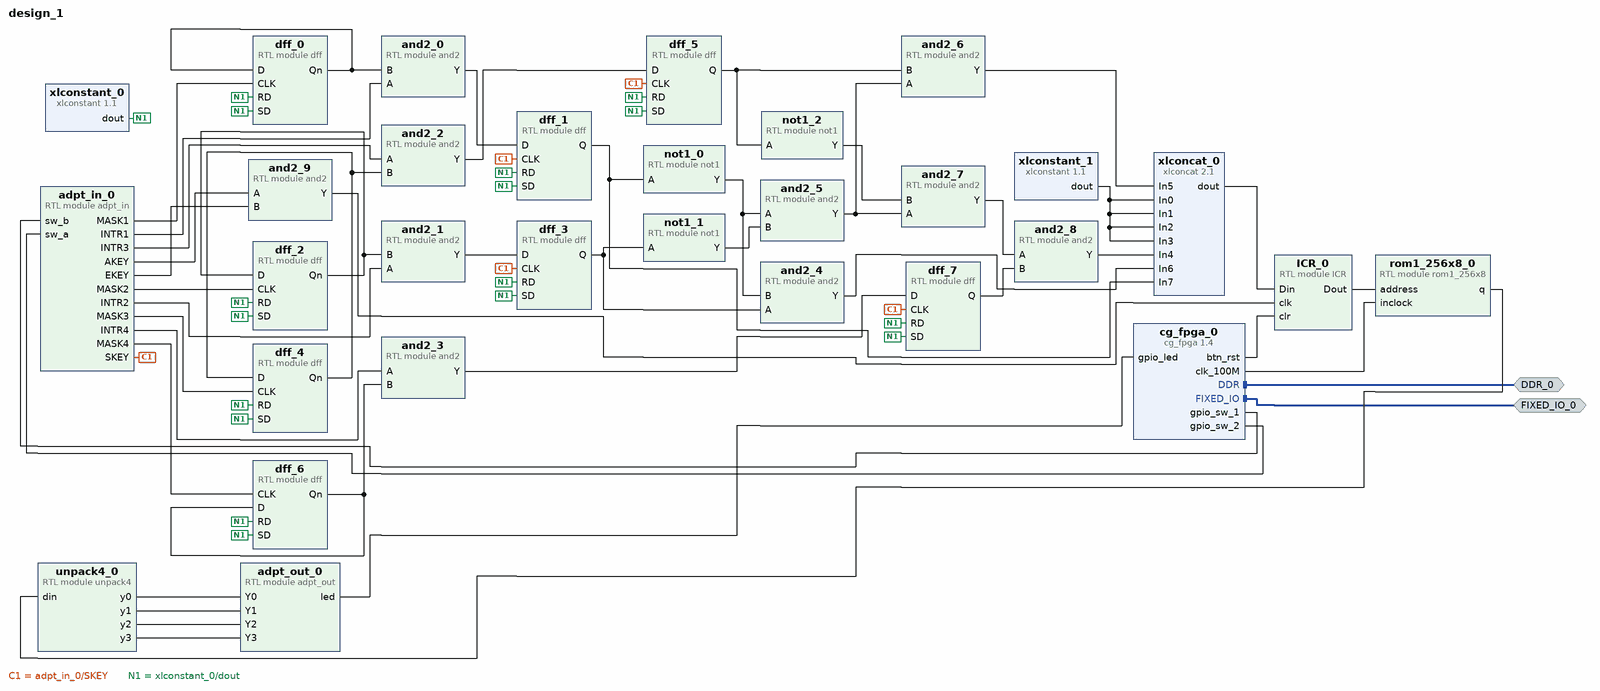
[diagram p0: block diagram of the top level]
# Vivado block design design_1, xc7z020clg400-1, Vivado 2024.2
create_bd_design design_1

create_bd_intf_port -mode Master -vlnv xilinx.com:display_processing_system7:fixedio_rtl:1.0 FIXED_IO_0
create_bd_intf_port -mode Master -vlnv xilinx.com:interface:ddrx_rtl:1.0 DDR_0

create_bd_cell -type ip -vlnv educg.net:user:cg_fpga:1.4 cg_fpga_0
create_bd_cell -type module -reference dff dff_0
create_bd_cell -type ip -vlnv xilinx.com:ip:xlconstant:1.1 xlconstant_0
create_bd_cell -type module -reference adpt_in adpt_in_0
create_bd_cell -type module -reference and2 and2_0
create_bd_cell -type module -reference dff dff_1
create_bd_cell -type module -reference dff dff_2
create_bd_cell -type module -reference and2 and2_1
create_bd_cell -type module -reference dff dff_3
create_bd_cell -type module -reference dff dff_4
create_bd_cell -type module -reference and2 and2_2
create_bd_cell -type module -reference dff dff_5
create_bd_cell -type module -reference dff dff_6
create_bd_cell -type module -reference and2 and2_3
create_bd_cell -type module -reference dff dff_7
create_bd_cell -type module -reference ICR ICR_0
create_bd_cell -type module -reference adpt_out adpt_out_0
create_bd_cell -type ip -vlnv xilinx.com:ip:xlconcat:2.1 xlconcat_0
set_property -dict {CONFIG.NUM_PORTS 8} [get_bd_cells xlconcat_0]
create_bd_cell -type ip -vlnv xilinx.com:ip:xlconstant:1.1 xlconstant_1
set_property -dict {CONFIG.CONST_VAL 0} [get_bd_cells xlconstant_1]
create_bd_cell -type module -reference not1 not1_0
create_bd_cell -type module -reference and2 and2_4
create_bd_cell -type module -reference not1 not1_1
create_bd_cell -type module -reference and2 and2_5
create_bd_cell -type module -reference and2 and2_6
create_bd_cell -type module -reference not1 not1_2
create_bd_cell -type module -reference and2 and2_7
create_bd_cell -type module -reference and2 and2_8
create_bd_cell -type module -reference and2 and2_9
create_bd_cell -type module -reference rom1_256x8 rom1_256x8_0
create_bd_cell -type module -reference unpack4 unpack4_0

# ---- connections ----

connect_bd_intf_net [get_bd_intf_ports DDR_0] [get_bd_intf_pins cg_fpga_0/DDR]
connect_bd_intf_net [get_bd_intf_ports FIXED_IO_0] [get_bd_intf_pins cg_fpga_0/FIXED_IO]
connect_bd_net [get_bd_pins ICR_0/Dout] [get_bd_pins rom1_256x8_0/address]
connect_bd_net [get_bd_pins adpt_in_0/AKEY] [get_bd_pins and2_9/A]
connect_bd_net [get_bd_pins adpt_in_0/EKEY] [get_bd_pins and2_9/B]
connect_bd_net [get_bd_pins adpt_in_0/INTR1] [get_bd_pins and2_0/A]
connect_bd_net [get_bd_pins adpt_in_0/INTR2] [get_bd_pins and2_1/A]
connect_bd_net [get_bd_pins adpt_in_0/INTR3] [get_bd_pins and2_2/A]
connect_bd_net [get_bd_pins adpt_in_0/INTR4] [get_bd_pins and2_3/A]
connect_bd_net [get_bd_pins adpt_in_0/MASK1] [get_bd_pins dff_0/CLK]
connect_bd_net [get_bd_pins adpt_in_0/MASK2] [get_bd_pins dff_2/CLK]
connect_bd_net [get_bd_pins adpt_in_0/MASK3] [get_bd_pins dff_4/CLK]
connect_bd_net [get_bd_pins adpt_in_0/MASK4] [get_bd_pins dff_6/CLK]
connect_bd_net [get_bd_pins adpt_in_0/SKEY] [get_bd_pins dff_1/CLK] [get_bd_pins dff_3/CLK] [get_bd_pins dff_5/CLK] [get_bd_pins dff_7/CLK]
connect_bd_net [get_bd_pins adpt_out_0/led] [get_bd_pins cg_fpga_0/gpio_led]
connect_bd_net [get_bd_pins and2_0/Y] [get_bd_pins dff_1/D]
connect_bd_net [get_bd_pins and2_1/Y] [get_bd_pins dff_3/D]
connect_bd_net [get_bd_pins and2_2/Y] [get_bd_pins dff_5/D]
connect_bd_net [get_bd_pins and2_3/Y] [get_bd_pins dff_7/D]
connect_bd_net [get_bd_pins and2_4/Y] [get_bd_pins xlconcat_0/In6]
connect_bd_net [get_bd_pins and2_5/Y] [get_bd_pins and2_6/A] [get_bd_pins and2_7/A]
connect_bd_net [get_bd_pins and2_6/Y] [get_bd_pins xlconcat_0/In5]
connect_bd_net [get_bd_pins and2_7/Y] [get_bd_pins and2_8/A]
connect_bd_net [get_bd_pins and2_8/Y] [get_bd_pins xlconcat_0/In4]
connect_bd_net [get_bd_pins and2_9/Y] [get_bd_pins ICR_0/clk]
connect_bd_net [get_bd_pins cg_fpga_0/btn_rst] [get_bd_pins ICR_0/clr]
connect_bd_net [get_bd_pins cg_fpga_0/clk_100M] [get_bd_pins rom1_256x8_0/inclock]
connect_bd_net [get_bd_pins cg_fpga_0/gpio_sw_1] [get_bd_pins adpt_in_0/sw_b]
connect_bd_net [get_bd_pins cg_fpga_0/gpio_sw_2] [get_bd_pins adpt_in_0/sw_a]
connect_bd_net [get_bd_pins dff_0/Qn] [get_bd_pins and2_0/B] [get_bd_pins dff_0/D]
connect_bd_net [get_bd_pins dff_1/Q] [get_bd_pins xlconcat_0/In7] [get_bd_pins not1_0/A]
connect_bd_net [get_bd_pins dff_2/Qn] [get_bd_pins and2_1/B] [get_bd_pins dff_2/D]
connect_bd_net [get_bd_pins dff_3/Q] [get_bd_pins and2_4/A] [get_bd_pins not1_1/A]
connect_bd_net [get_bd_pins dff_4/Qn] [get_bd_pins and2_2/B] [get_bd_pins dff_4/D]
connect_bd_net [get_bd_pins dff_5/Q] [get_bd_pins and2_6/B] [get_bd_pins not1_2/A]
connect_bd_net [get_bd_pins dff_6/Qn] [get_bd_pins and2_3/B] [get_bd_pins dff_6/D]
connect_bd_net [get_bd_pins dff_7/Q] [get_bd_pins and2_8/B]
connect_bd_net [get_bd_pins not1_0/Y] [get_bd_pins and2_4/B] [get_bd_pins and2_5/A]
connect_bd_net [get_bd_pins not1_1/Y] [get_bd_pins and2_5/B]
connect_bd_net [get_bd_pins not1_2/Y] [get_bd_pins and2_7/B]
connect_bd_net [get_bd_pins rom1_256x8_0/q] [get_bd_pins unpack4_0/din]
connect_bd_net [get_bd_pins unpack4_0/y0] [get_bd_pins adpt_out_0/Y0]
connect_bd_net [get_bd_pins unpack4_0/y1] [get_bd_pins adpt_out_0/Y1]
connect_bd_net [get_bd_pins unpack4_0/y2] [get_bd_pins adpt_out_0/Y2]
connect_bd_net [get_bd_pins unpack4_0/y3] [get_bd_pins adpt_out_0/Y3]
connect_bd_net [get_bd_pins xlconcat_0/dout] [get_bd_pins ICR_0/Din]
connect_bd_net [get_bd_pins xlconstant_0/dout] \
  [get_bd_pins dff_0/RD] [get_bd_pins dff_0/SD] [get_bd_pins dff_1/RD] [get_bd_pins dff_1/SD] [get_bd_pins dff_2/RD] \
  [get_bd_pins dff_2/SD] [get_bd_pins dff_3/RD] [get_bd_pins dff_3/SD] [get_bd_pins dff_4/RD] [get_bd_pins dff_4/SD] \
  [get_bd_pins dff_5/RD] [get_bd_pins dff_5/SD] [get_bd_pins dff_6/RD] [get_bd_pins dff_6/SD] [get_bd_pins dff_7/RD] \
  [get_bd_pins dff_7/SD]
connect_bd_net [get_bd_pins xlconstant_1/dout] \
  [get_bd_pins xlconcat_0/In0] [get_bd_pins xlconcat_0/In1] [get_bd_pins xlconcat_0/In2] [get_bd_pins xlconcat_0/In3]

validate_bd_design
save_bd_design
